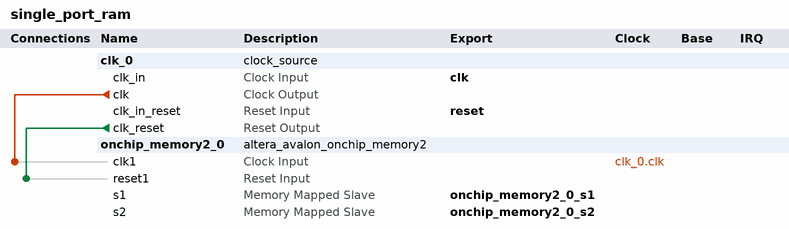
[diagram p0: system contents]
# Platform Designer (Qsys) system single_port_ram, Cyclone V 5CSXFC6D6F31I7
# Parameters at their usual value, and those the tool derives, are not listed.
package require -exact qsys 19.1
create_system single_port_ram
set_project_property DEVICE_FAMILY {Cyclone V}
set_project_property DEVICE 5CSXFC6D6F31I7

add_instance clk_0 clock_source 19.1
set_instance_parameter_value clk_0 clockFrequency 50000000

add_instance onchip_memory2_0 altera_avalon_onchip_memory2 19.1
set_instance_parameter_value onchip_memory2_0 dataWidth 512
set_instance_parameter_value onchip_memory2_0 dualPort true
set_instance_parameter_value onchip_memory2_0 initMemContent false
set_instance_parameter_value onchip_memory2_0 initializationFileName onchip_mem.hex
set_instance_parameter_value onchip_memory2_0 memorySize 4096
set_instance_parameter_value onchip_memory2_0 singleClockOperation true

# connections
add_connection clk_0.clk onchip_memory2_0.clk1 clock
add_connection clk_0.clk_reset onchip_memory2_0.reset1 reset

# exported interfaces
add_interface clk clock sink
set_interface_property clk EXPORT_OF clk_0.clk_in
add_interface onchip_memory2_0_s1 avalon slave
set_interface_property onchip_memory2_0_s1 EXPORT_OF onchip_memory2_0.s1
add_interface onchip_memory2_0_s2 avalon slave
set_interface_property onchip_memory2_0_s2 EXPORT_OF onchip_memory2_0.s2
add_interface reset reset sink
set_interface_property reset EXPORT_OF clk_0.clk_in_reset

set_interconnect_requirement {$system} qsys_mm.clockCrossingAdapter HANDSHAKE
set_interconnect_requirement {$system} qsys_mm.enableEccProtection FALSE
set_interconnect_requirement {$system} qsys_mm.insertDefaultSlave FALSE
set_interconnect_requirement {$system} qsys_mm.maxAdditionalLatency 1

save_system single_port_ram.qsys
